# Altium schematic sheet spb_sch1.SchDoc
size A4
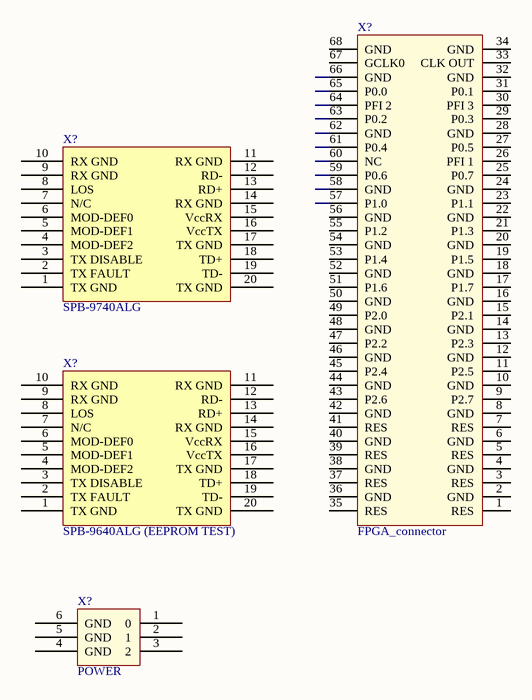
[diagram p0: spb_sch1.SchDoc]

## Parts
(Parts that share a designator on the sheet are numbered #1, #2 ... from top to bottom, then left to right.)
X?#1  SPB-9740ALG  [SFP-20pin]
X?#2  SPB-9640ALG (EEPROM TEST)  [SFP-20pin]
X?#3  FPGA_connector  [FPGA]
X?#4  POWER  [POWER]

## Nets

Not connected (* = marked no-connect by the designer): X?#1 1(TX_GND) 2(TX_FAULT) 3(TX_DISABLE) 4(MOD-DEF2) 5(MOD-DEF1) 6(MOD-DEF0) 7(N/C) 8(LOS) 9(RX_GND) 10(RX_GND) 11(RX_GND) 12(RD-) 13(RD+) 14(RX_GND) 15(VccRX) 16(VccTX) 17(TX_GND) 18(TD+) 19(TD-) 20(TX_GND); X?#2 1(TX_GND) 2(TX_FAULT) 3(TX_DISABLE) 4(MOD-DEF2) 5(MOD-DEF1) 6(MOD-DEF0) 7(N/C) 8(LOS) 9(RX_GND) 10(RX_GND) 11(RX_GND) 12(RD-) 13(RD+) 14(RX_GND) 15(VccRX) 16(VccTX) 17(TX_GND) 18(TD+) 19(TD-) 20(TX_GND); X?#3 1(RES) 2(GND) 3(RES) 4(GND) 5(RES) 6(GND) 7(RES) 8(GND) 9(P2.7) 10(GND) 11(P2.5) 12(GND) 13(P2.3) 14(GND) 15(P2.1) 16(GND) 17(P1.7) 18(GND) 19(P1.5) 20(GND) 21(P1.3) 22(GND) 23(P1.1) 24(GND) 25(P0.7) 26(PFI_1) 27(P0.5) 28(GND) 29(P0.3) 30(PFI_3) 31(P0.1) 32(GND) 33(CLK_OUT) 34(GND) 35(RES) 36(GND) 37(RES) 38(GND) 39(RES) 40(GND) 41(RES) 42(GND) 43(P2.6) 44(GND) 45(P2.4) 46(GND) 47(P2.2) 48(GND) 49(P2.0) 50(GND) 51(P1.6) 52(GND) 53(P1.4) 54(GND) 55(P1.2) 56(GND) 57(P1.0) 58(GND) 59(P0.6) 60(NC) 61(P0.4) 62(GND) 63(P0.2) 64(PFI_2) 65(P0.0) 66(GND) 67(GCLK0) 68(GND); X?#4 1(0) 2(1) 3(2) 4(GND) 5(GND) 6(GND)

## Library data of the parts
X?#1 X?#2 = SFP-20pin